# EAGLE design new_PowerBoard_V1 (EAGLE 5.11)
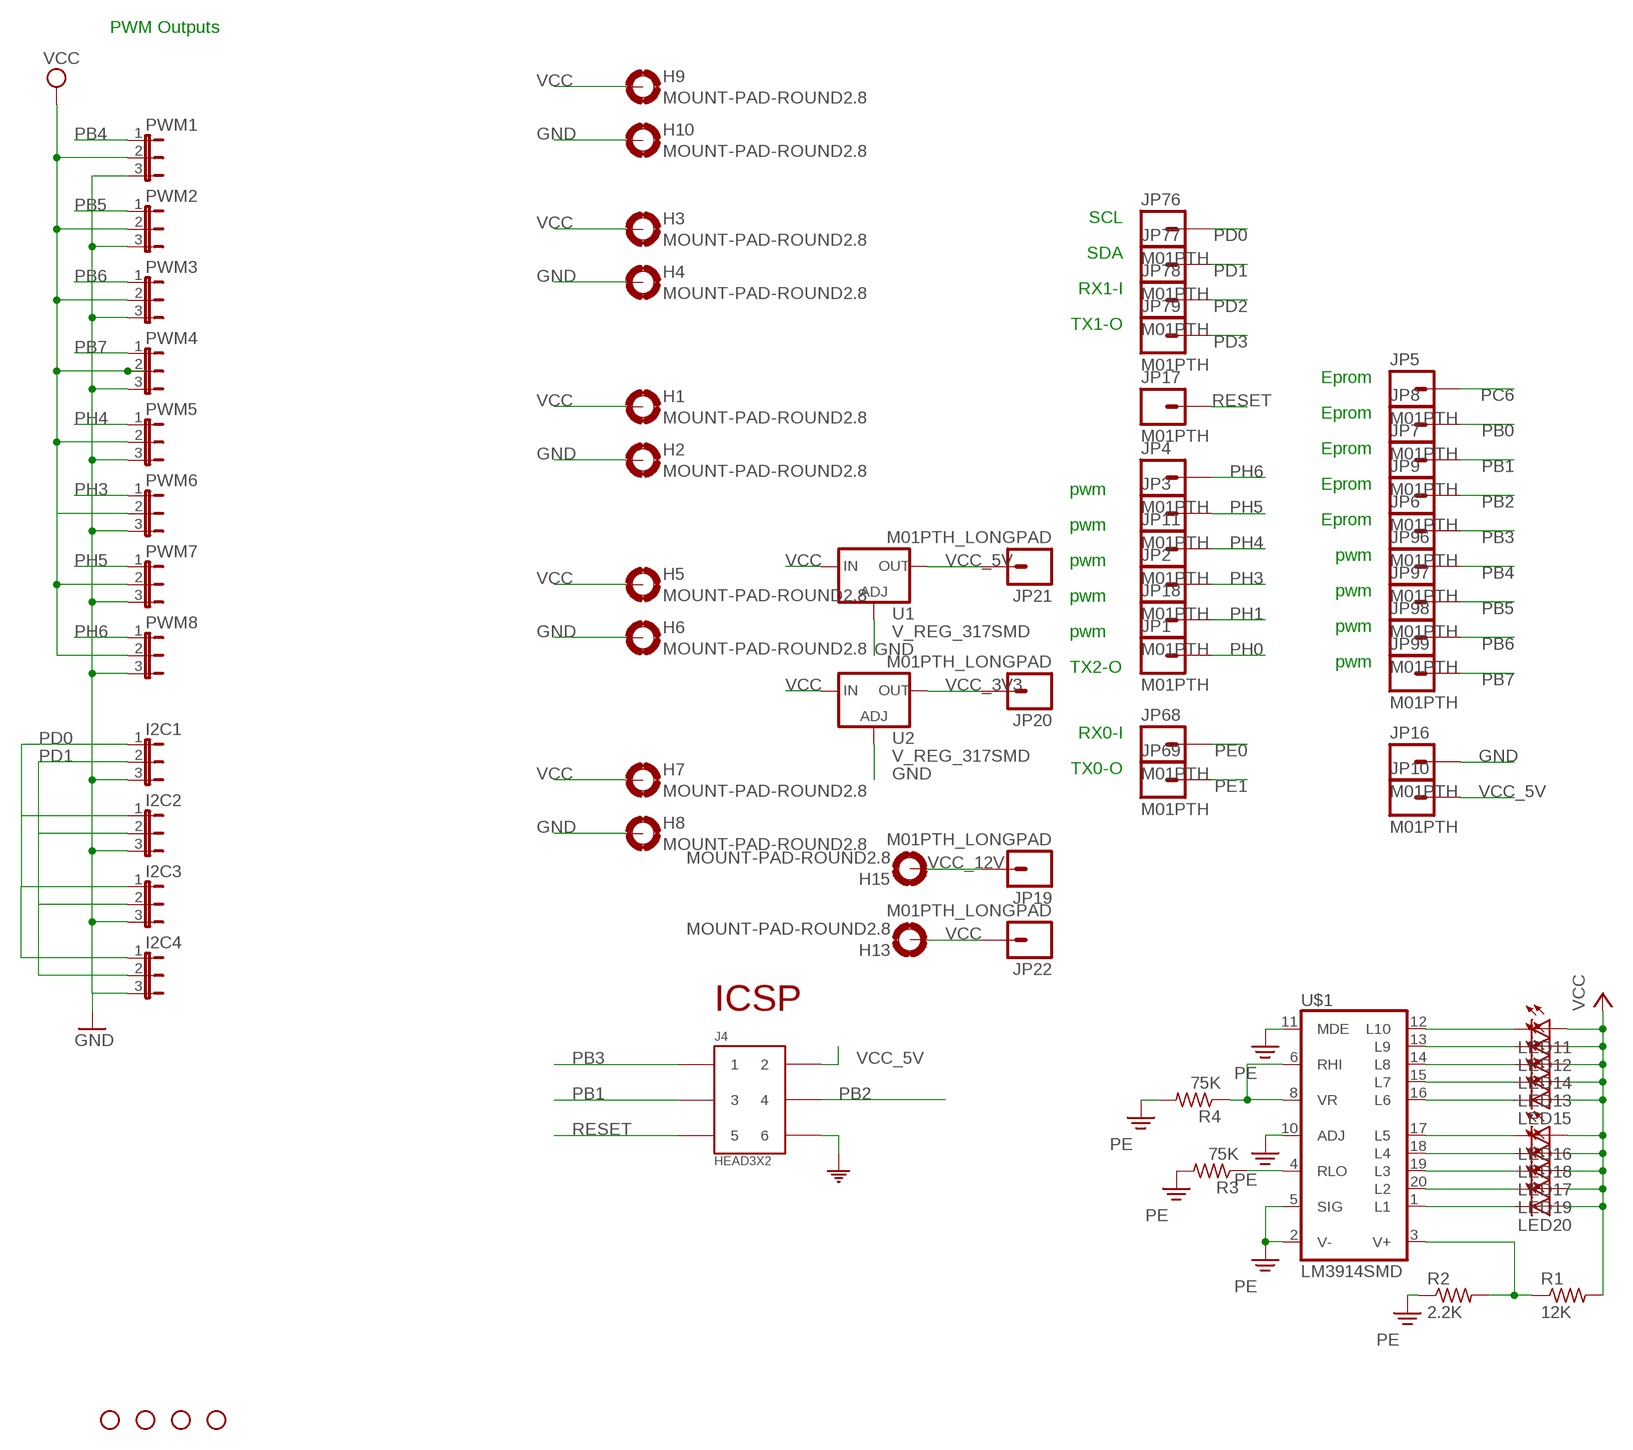
[diagram p0: schematic, sheet 1]

## Parts
H1  MOUNT-PAD-ROUND2.8  [2,8-PAD]
H2  MOUNT-PAD-ROUND2.8  [2,8-PAD]
H3  MOUNT-PAD-ROUND2.8  [2,8-PAD]
H4  MOUNT-PAD-ROUND2.8  [2,8-PAD]
H5  MOUNT-PAD-ROUND2.8  [2,8-PAD]
H6  MOUNT-PAD-ROUND2.8  [2,8-PAD]
H7  MOUNT-PAD-ROUND2.8  [2,8-PAD]
H8  MOUNT-PAD-ROUND2.8  [2,8-PAD]
H9  MOUNT-PAD-ROUND2.8  [2,8-PAD]
H10  MOUNT-PAD-ROUND2.8  [2,8-PAD]
H13  MOUNT-PAD-ROUND2.8  [2,8-PAD]
H15  MOUNT-PAD-ROUND2.8  [2,8-PAD]
I2C1  JP2E  [JP2]
I2C2  JP2E  [JP2]
I2C3  JP2E  [JP2]
I2C4  JP2E  [JP2]
J4  HEAD3X2  [HEAD3X2]
JP1  M01PTH  [1X01]
JP2  M01PTH  [1X01]
JP3  M01PTH  [1X01]
JP4  M01PTH  [1X01]
JP5  M01PTH  [1X01]
JP6  M01PTH  [1X01]
JP7  M01PTH  [1X01]
JP8  M01PTH  [1X01]
JP9  M01PTH  [1X01]
JP10  M01PTH  [1X01]
JP11  M01PTH  [1X01]
JP12  STAND-OFF  [STAND-OFF]
JP13  STAND-OFF  [STAND-OFF]
JP14  STAND-OFF  [STAND-OFF]
JP15  STAND-OFF  [STAND-OFF]
JP16  M01PTH  [1X01]
JP17  M01PTH  [1X01]
JP18  M01PTH  [1X01]
JP19  M01PTH_LONGPAD  [1X01_LONGPAD]
JP20  M01PTH_LONGPAD  [1X01_LONGPAD]
JP21  M01PTH_LONGPAD  [1X01_LONGPAD]
JP22  M01PTH_LONGPAD  [1X01_LONGPAD]
JP68  M01PTH  [1X01]
JP69  M01PTH  [1X01]
JP76  M01PTH  [1X01]
JP77  M01PTH  [1X01]
JP78  M01PTH  [1X01]
JP79  M01PTH  [1X01]
JP96  M01PTH  [1X01]
JP97  M01PTH  [1X01]
JP98  M01PTH  [1X01]
JP99  M01PTH  [1X01]
LED11  LEDCHIP-LED0603  [CHIP-LED0603]
LED12  LEDCHIP-LED0603  [CHIP-LED0603]
LED13  LEDCHIP-LED0603  [CHIP-LED0603]
LED14  LEDCHIP-LED0603  [CHIP-LED0603]
LED15  LEDCHIP-LED0603  [CHIP-LED0603]
LED16  LEDCHIP-LED0603  [CHIP-LED0603]
LED17  LEDCHIP-LED0603  [CHIP-LED0603]
LED18  LEDCHIP-LED0603  [CHIP-LED0603]
LED19  LEDCHIP-LED0603  [CHIP-LED0603]
LED20  LEDCHIP-LED0603  [CHIP-LED0603]
PWM1  JP2E  [JP2]
PWM2  JP2E  [JP2]
PWM3  JP2E  [JP2]
PWM4  JP2E  [JP2]
PWM5  JP2E  [JP2]
PWM6  JP2E  [JP2]
PWM7  JP2E  [JP2]
PWM8  JP2E  [JP2]
R1  12K  R-US_R0805  [R0805]
R2  2.2K  R-US_R0805  [R0805]
R3  75K  R-US_R0805  [R0805]
R4  75K  R-US_R0805  [R0805]
U1  V_REG_317SMD  [SOT223]
U2  V_REG_317SMD  [SOT223]
U$1  LM3914SMD  [PLCC20S]

## Nets
GND: H2.B2,8(MOUNT) H4.B2,8(MOUNT) H6.B2,8(MOUNT) H8.B2,8(MOUNT) H10.B2,8(MOUNT) I2C1.3 I2C2.3 I2C3.3 I2C4.3 J4.6 JP16.1 PWM1.3 PWM2.3 PWM3.3 PWM4.3 PWM5.3 PWM6.3 PWM7.3 PWM8.3 U1.1(ADJ) U2.1(ADJ) ; supply symbol labelled COM
N$1: R1.1 R2.2 U$1.3(V+)
N$2: LED11.C U$1.12(L10)
N$3: LED12.C U$1.13(L9)
N$4: LED14.C U$1.14(L8)
N$5: LED13.C U$1.15(L7)
N$7: LED15.C U$1.16(L6)
N$8: LED16.C U$1.17(L5)
N$9: LED18.C U$1.18(L4)
N$10: LED17.C U$1.19(L3)
N$11: LED19.C U$1.20(L2)
N$12: LED20.C U$1.1(L1)
N$14: R3.1 U$1.4(RLO)
N$15: R4.1 U$1.6(RHI) U$1.8(VR)
PB0: JP8.1
PB1: J4.3 JP7.1
PB2: J4.4 JP9.1
PB3: J4.1 JP6.1
PB4: JP96.1 PWM1.1
PB5: JP97.1 PWM2.1
PB6: JP98.1 PWM3.1
PB7: JP99.1 PWM4.1
PC6: JP5.1
PD0: I2C1.1 I2C2.1 I2C3.1 I2C4.1 JP76.1
PD1: I2C1.2 I2C2.2 I2C3.2 I2C4.2 JP77.1
PD2: JP78.1
PD3: JP79.1
PE: R2.1 R3.2 R4.2 U$1.2(V-) U$1.5(SIG) U$1.10(ADJ) U$1.11(MDE)
PE0: JP68.1
PE1: JP69.1
PH0: JP1.1
PH1: JP18.1
PH3: JP2.1 PWM6.1
PH4: JP11.1 PWM5.1
PH5: JP3.1 PWM7.1
PH6: JP4.1 PWM8.1
RESET: J4.5 JP17.1
VCC: H1.B2,8(MOUNT) H3.B2,8(MOUNT) H5.B2,8(MOUNT) H7.B2,8(MOUNT) H9.B2,8(MOUNT) H13.B2,8(MOUNT) JP22.1 LED11.A LED12.A LED13.A LED14.A LED15.A LED16.A LED17.A LED18.A LED19.A LED20.A PWM7.2 PWM8.2 R1.2 U1.3(IN) U2.3(IN)
VCC_3V3: JP20.1 U2.2(OUT)
VCC_5V: J4.2 JP10.1 JP21.1 PWM1.2 PWM2.2 PWM3.2 PWM4.2 PWM5.2 PWM6.2 U1.2(OUT) ; supply symbol labelled VCC
VCC_12V: H15.B2,8(MOUNT) JP19.1

## Notes on the sheet
- PWM Outputs
- SCL
- SDA
- RX1-I
- TX1-O
- Eprom
- Eprom
- Eprom
- Eprom
- pwm
- Eprom
- pwm
- pwm
- pwm
- pwm
- pwm
- pwm
- pwm
- pwm
- TX2-O
- RX0-I
- TX0-O
- ICSP

## Library data of the parts
H1-H10 H13 H15 = holes:MOUNT-PAD-ROUND: MOUNTING PAD, round
I2C1-I2C4 PWM1-PWM8 = jumper:JP2E: JUMPER
J4 = MyCON2:HEAD3X2
JP1-JP11 JP16-JP18 JP68 JP69 JP76-JP79 JP96-JP99 = DIYdrones3:M01: Header 1 Standard 1-pin 0.1" header. Use with straight break away headers (SKU : PRT-00116), right angle break away headers (PRT-00553), swiss pins (PRT-00743), machine pins (PRT-00117), and female headers (PRT-00115).
JP12-JP15 = SparkFun:STAND-OFF: Stand Off This is the mechanical footprint for a #4 phillips button head screw. Use the keepout ring to avoid running the screw head into surrounding components. SKU : PRT-00447
JP19-JP22 = SparkFun:M01: Header 1 Standard 1-pin 0.1" header. Use with straight break away headers (SKU : PRT-00116), right angle break away headers (PRT-00553), swiss pins (PRT-00743), machine pins (PRT-00117), and female headers (PRT-00115).
LED11-LED20 = led:LED: LED OSRAM: - CHIPLED LG R971, LG N971, LY N971, LG Q971, LY Q971, LO R971, LY R971 LH N974, LH R974 LS Q976, LO Q976, LY Q976 LO Q996 - Hyper CHIPLED LW Q18S LB Q993, LB Q99A, LB R99A - SideLED LS A670, LO A670, LY A670, LG A670, LP A670 LB A673, LV A673, LT A673, LW A673 LH A674 LY A675 LS A676, LA A676, LO A676, LY A676, LW A676 LS A679, LY A679, LG A679 - Hyper Micro SIDELED® LS Y876, LA Y876, LO Y876, LY Y876 LT Y87S - SmartLED LW L88C, LW L88S LB L89C, LB L89S, LG L890 LS L89K, LO L89K, LY L89K LS L896, LA L896, LO L896, LY L896 - TOPLED LS T670, LO T670, LY T670, LG T670, LP T670 LSG T670, LSP T670, LSY T670, LOP T670, LYG T670 LG T671, LOG T671, LSG T671 LB T673, LV T673, LT T673, LW T673 LH T674 LS T676, LA T676, LO T676, LY T676, LB T676, LH T676, LSB T676, LW T676 LB T67C, LV T67C, LT T67C, LS T67K, LO T67K, LY T67K, LW E67C LS E67B, LA E67B, LO E67B, LY E67B, LB E67C, LV E67C, LT E67C LW T67C LS T679, LY T679, LG T679 LS T770, LO T770, LY T770, LG T770, LP T770 LB T773, LV T773, LT T773, LW T773 LH T774 LS E675, LA E675, LY E675, LS T675 LS T776, LA T776, LO T776, LY T776, LB T776 LHGB T686 LT T68C, LB T68C - Hyper Mini TOPLED® LB M676 - Mini TOPLED Santana® LG M470 LS M47K, LO M47K, LY M47K Source: http://www.osram.convergy.de LUXEON: - LUMILED® LXK2-PW12-R00, LXK2-PW12-S00, LXK2-PW14-U00, LXK2-PW14-V00 LXK2-PM12-R00, LXK2-PM12-S00, LXK2-PM14-U00 LXK2-PE12-Q00, LXK2-PE12-R00, LXK2-PE12-S00, LXK2-PE14-T00, LXK2-PE14-U00 LXK2-PB12-K00, LXK2-PB12-L00, LXK2-PB12-M00, LXK2-PB14-N00, LXK2-PB14-P00, LXK2-PB14-Q00 LXK2-PR12-L00, LXK2-PR12-M00, LXK2-PR14-Q00, LXK2-PR14-R00 LXK2-PD12-Q00, LXK2-PD12-R00, LXK2-PD12-S00 LXK2-PH12-R00, LXK2-PH12-S00 LXK2-PL12-P00, LXK2-PL12-Q00, LXK2-PL12-R00 Source: www.luxeon.com KINGBRIGHT: KA-3528ASYC Source: www.kingbright.com
R1-R4 = resistor:R-US_: RESISTOR, American symbol
U1 U2 = SparkFun:V_REG_317: Voltage Regulator Standard LM317 adjustable voltage regulator. AOI (Adjust Output Input). Google 'LM317 Calculator' for easy to use app to get the two resistor values needed. 240/720 for 5V output. 240/390 for 3.3V output. Spark Fun Electronics SKU : COM-00527
U$1 = linear:LM3914SMD

## Board
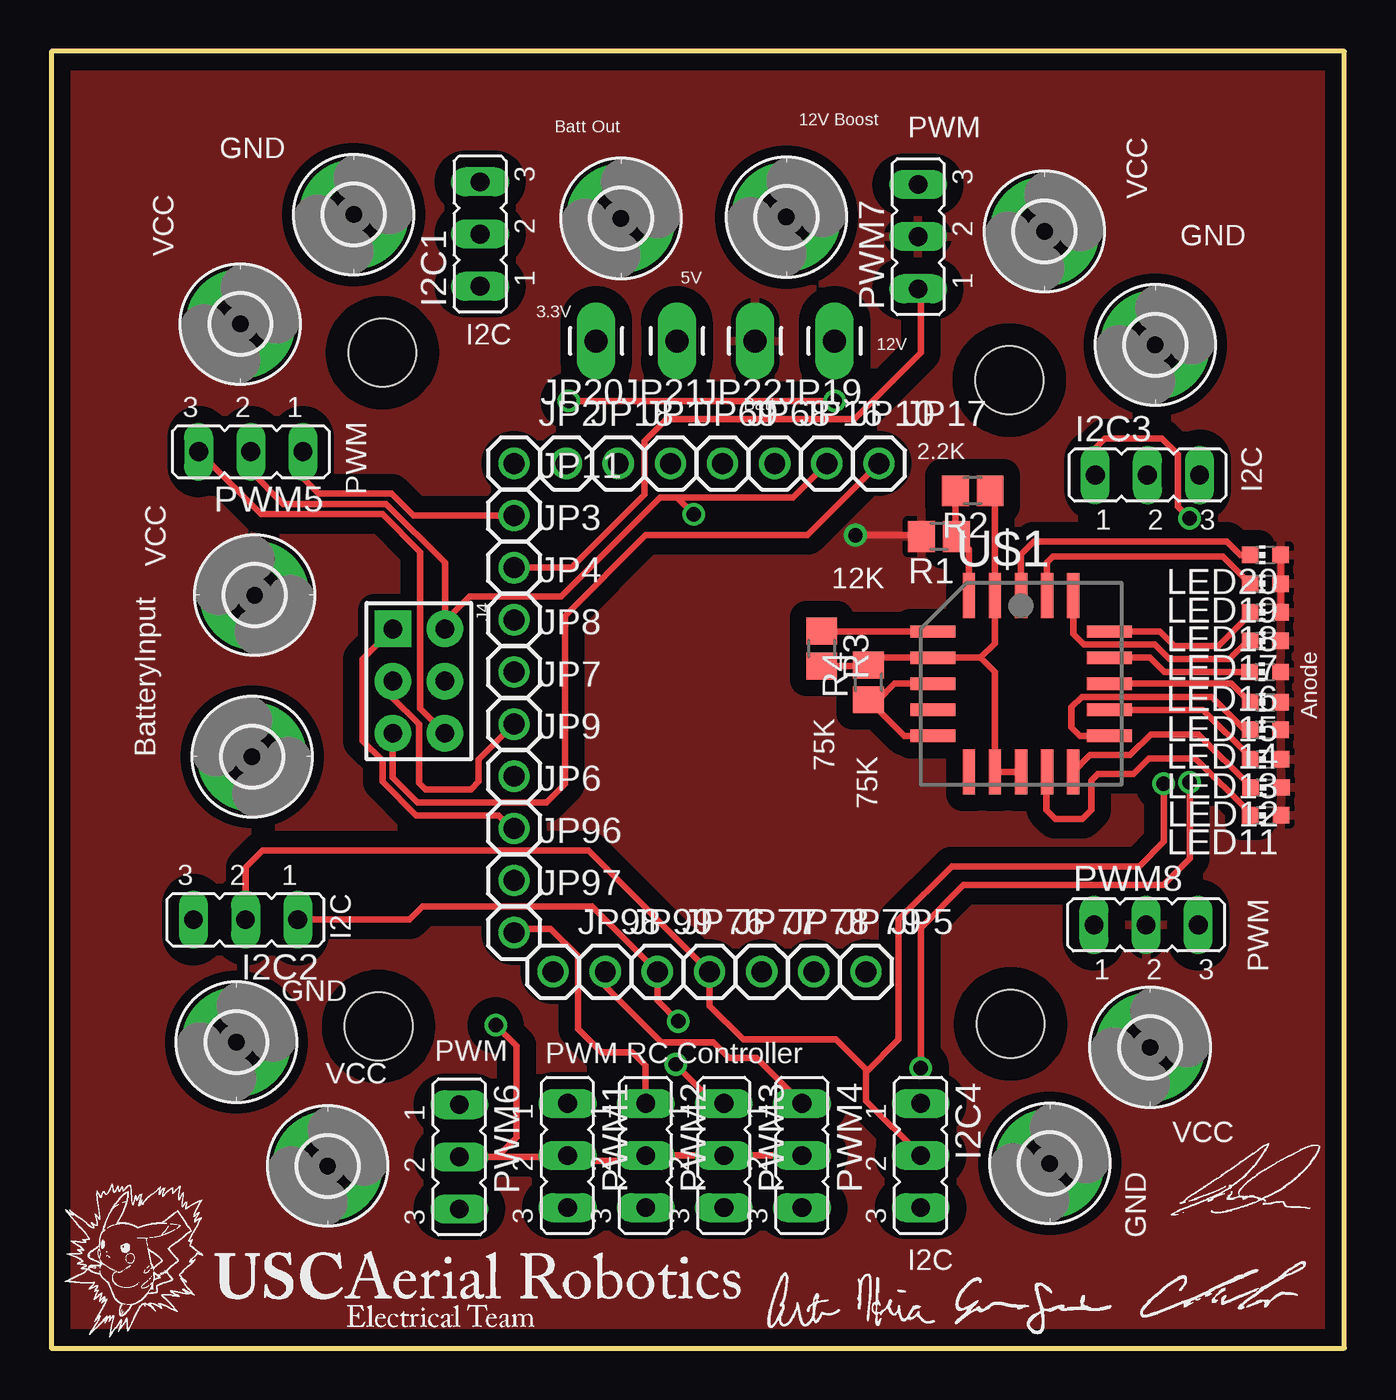
[diagram p1: board, top side]
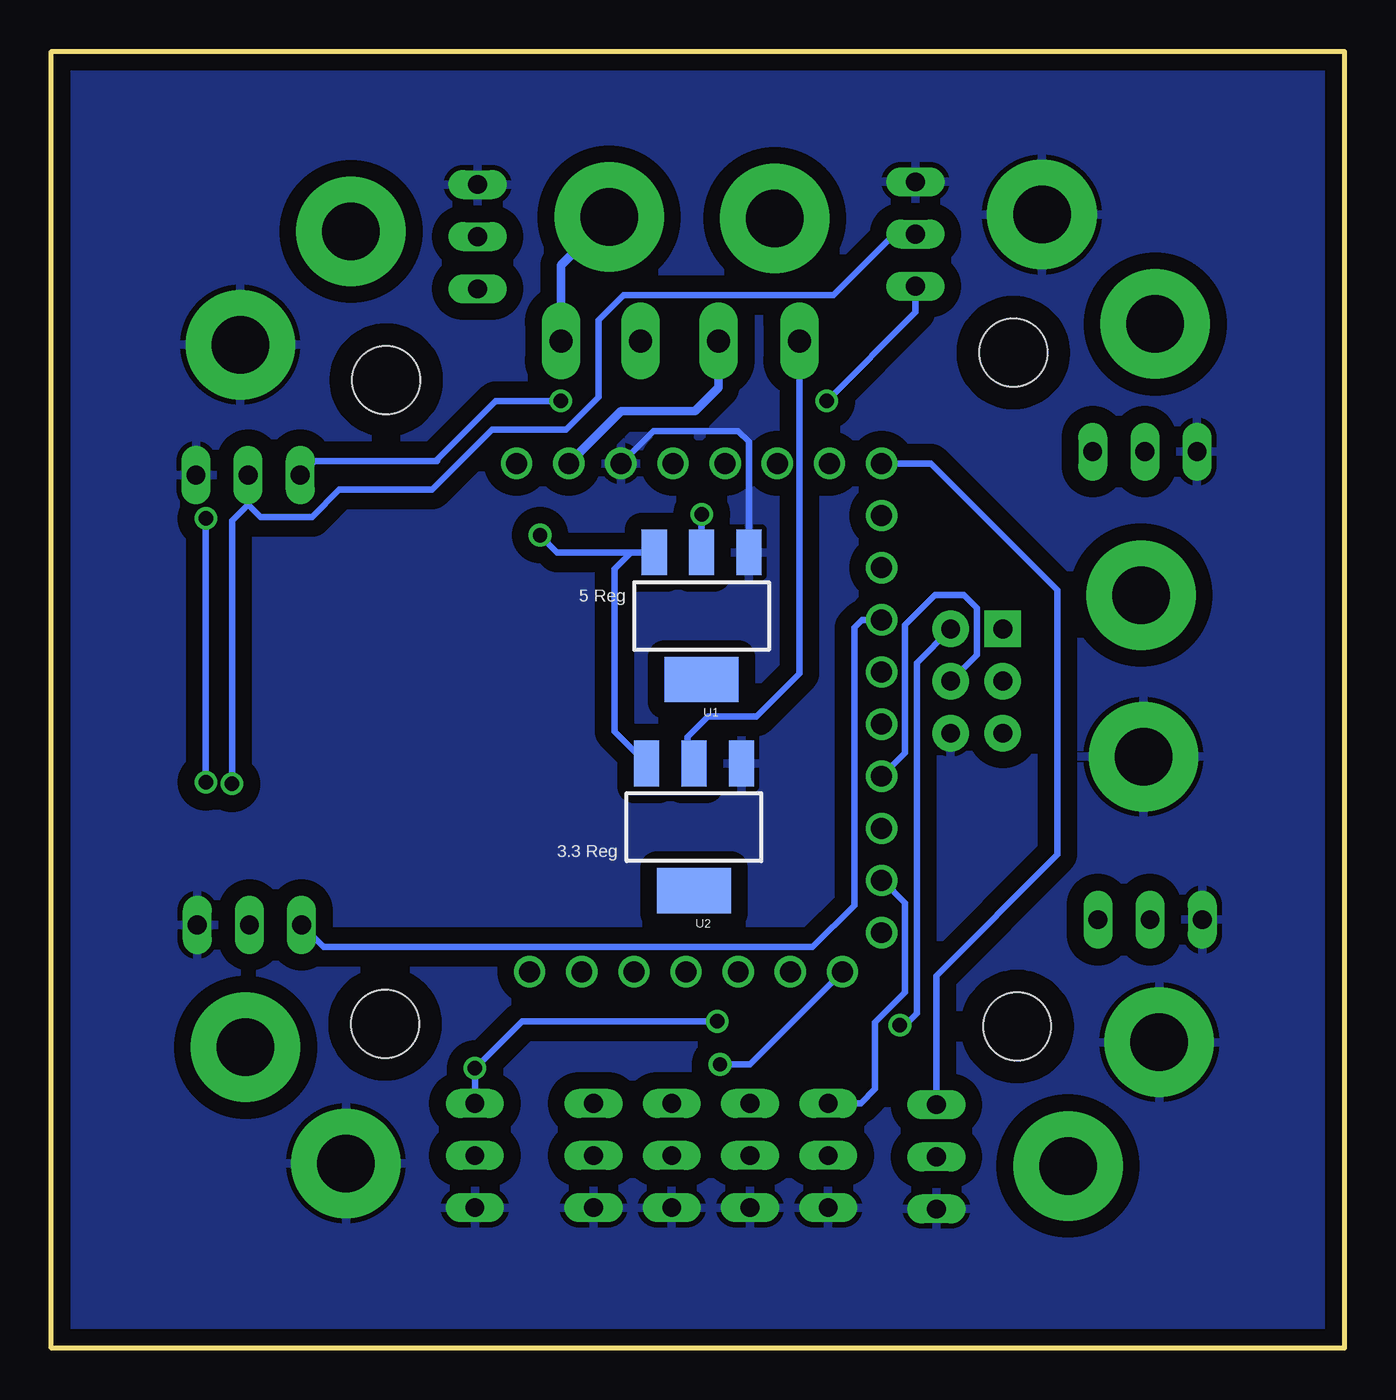
[diagram p2: board, bottom side, seen from below]

Size 62.99 x 63.18 mm. Coordinates in mm from the lower left corner, seen from the top.
Outline: 0,0 62.99,0 62.99,63.18 0,63.18 0,0
Copper layers (1*16): Top 0.0356mm / dielectric 1.5011mm / Bottom 0.0356mm
Design rules "Aerial-2Layer *": minimum track width 10mil, minimum drill 15mil, track to track 6mil, track to pad 6mil, pad to pad 6mil, via to via 6mil, smd to smd 6mil, copper to edge 15mil, drill to drill 8mil, minimum pad ring 10mil, minimum via ring 8mil, stop-mask expansion 4mil, vias tented up to drill 0mil, thermal gap 10mil

### Footprints (pad centres in the part's own frame; a part is rotated, then mirrored left to right if it is on the bottom)
2,8-PAD = drill 2.8 pad 5.334 round: B2,8 0,0
JP2 = drill 0.914 long: 1 -2.54,0; 2 0,0; 3 2.54,0
HEAD3X2 = drill 0.914 pad 1.778 square: 1 0,0 | drill 0.914 pad 1.778 round: 2 0,2.54; 3 2.54,0; 4 2.54,2.54; 5 5.08,0; 6 5.08,2.54
1X01 = drill 1.016 round: 1 0,0
STAND-OFF = hole 3.302: 0,0
1X01_LONGPAD = drill 1.118 pad 1.88 long: 1 0,0
CHIP-LED0603 = smd 0.8 x 0.8: A 0,-0.75; C 0,0.75
R0805 = smd 1.3 x 1.5: 1 -0.85,0; 2 0.85,0
SOT223 = smd 1.219 x 2.235: 1 -2.311,-3.099; 2 0,-3.099; 3 2.311,-3.099 | smd 3.6 x 2.2: 4 0,3.099
PLCC20S = smd 0.6 x 2.2: 1 0,4.3; 2 -1.27,4.3; 3 -2.54,4.3; 9 -2.54,-4.3; 10 -1.27,-4.3; 11 0,-4.3; 12 1.27,-4.3; 13 2.54,-4.3; 19 2.54,4.3; 20 1.27,4.3 | smd 2.2 x 0.6: 4 -4.3,2.54; 5 -4.3,1.27; 6 -4.3,0; 7 -4.3,-1.27; 8 -4.3,-2.54; 14 4.3,-2.54; 15 4.3,-1.27; 16 4.3,0; 17 4.3,1.27; 18 4.3,2.54

### Placement (x,y rotation side)
H1  9.91,36.69 270 top
H2  9.78,28.82 270 top
H3  53.53,14.66 0 top
H4  48.64,9 0 top
H5  48.39,54.41 0 top
H6  53.78,48.88 0 top
H7  9.21,49.9 0 top
H8  14.73,55.23 0 top
H9  13.46,8.88 0 top
H10  9.02,14.91 0 top
H13  27.75,55.04 0 top
H15  35.81,55.11 0 top
I2C1  20.89,54.28 90 top
I2C2  9.46,20.88 180 top
I2C3  53.4,42.53 0 top
I2C4  42.35,9.39 270 top
J4  16.64,35.04 270 top
JP1  27.62,43.1 0 top
JP2  22.54,43.1 0 top
JP3  22.54,38.02 0 top
JP4  22.54,35.48 0 top
JP5  39.69,18.34 0 top
JP6  22.54,25.32 0 top
JP7  22.54,30.4 0 top
JP8  22.54,32.94 0 top
JP9  22.54,27.86 0 top
JP10  37.78,43.1 0 top
JP11  22.54,40.56 0 top
JP12  46.74,15.8 0 top
JP13  15.94,15.67 0 top
JP14  46.67,47.17 0 top
JP15  16.13,48.5 0 top
JP16  35.24,43.1 0 top
JP17  40.32,43.1 0 top
JP18  25.08,43.1 0 top
JP19  38.16,49.07 180 top
JP20  26.54,49.07 180 top
JP21  30.48,49.07 180 top
JP22  34.29,49.07 180 top
JP68  32.7,43.1 0 top
JP69  30.16,43.1 0 top
JP76  29.53,18.34 0 top
JP77  32.07,18.34 0 top
JP78  34.61,18.34 0 top
JP79  37.15,18.34 0 top
JP96  22.54,22.78 0 top
JP97  22.54,20.24 0 top
JP98  24.45,18.34 0 top
JP99  26.99,18.34 0 top
LED11  59.16,25.96 90 top
LED12  59.18,27.32 90 top
LED13  59.16,28.69 90 top
LED14  59.14,30.14 90 top
LED15  59.14,31.47 90 top
LED16  59.13,32.94 90 top
LED17  59.14,34.46 90 top
LED18  59.14,35.85 90 top
LED19  59.14,37.25 90 top
LED20  59.14,38.65 90 top
PWM1  25.15,9.39 270 top
PWM2  28.96,9.39 270 top
PWM3  32.77,9.39 270 top
PWM4  36.58,9.39 270 top
PWM5  9.72,43.68 180 top
PWM6  19.88,9.32 270 top
PWM7  42.23,54.15 90 top
PWM8  53.34,20.62 0 top
R1  43.24,39.55 180 top
R2  44.89,41.77 180 top
R3  37.53,34.09 270 top
R4  39.81,32.44 90 top
U1  31.31,35.67 180 bottom
U2  31.69,25.39 180 bottom
U$1  47.24,32.37 0 top

### Tracks (layer width: path | path; a pad name or v marks a point on that pad's centre or on a via)
GND
  Top 0.305: J4.6 17.97,31.17 17.97,38.79 16.13,40.63 10.22,40.63 PWM5.3
  Bottom 0.305: U1.1 28.99,44.16 29.53,44.69 33.65,44.69 JP16.1
  pour Bottom (isolate 0.813): -0.76,64.01 63.56,63.88 63.69,-0.7 -0.76,-0.83
N$1
  Top 0.305: U$1.3 44.7,38.94 R1.1 44.04,39.6 R2.2
N$2
  Top 0.305: LED11.C 58.41,26.07 55.74,28.74 53.48,28.74 52.72,27.98 50.99,27.98 50.66,27.65 50.66,26.23 50.23,25.79 48.91,25.79 48.48,26.23 48.48,28.03 U$1.12
N$3
  Top 0.305: LED12.C 58.43,27.37 55.89,29.91 53.56,29.91 52.54,28.89 50.6,28.89 U$1.13
N$4
  Top 0.305: LED14.C 58.13,30.14 56.53,31.74 50.2,31.74 49.7,31.23 49.7,30.24 50.1,29.83 U$1.14
N$5
  Top 0.305: LED13.C 58.41,28.79 56.1,31.1 U$1.15
N$7
  Top 0.305: U$1.16 57.49,32.37 LED15.C
N$8
  Top 0.305: LED16.C 54.23,32.94 53.53,33.64 U$1.17
N$9
  Top 0.305: LED18.C 58.39,35.74 56.86,34.2 54.72,34.2 54.01,34.91 U$1.18
N$10
  Top 0.305: LED17.C 58.28,34.46 57.39,33.57 54.47,33.57 53.76,34.28 50.3,34.28 49.8,34.79 49.8,36.66 U$1.19
N$11
  Top 0.305: U$1.20 48.51,38.28 48.81,38.57 57.07,38.57 LED19.C
N$12
  Top 0.305: LED20.C 57.92,38.65 57.26,39.31 47.87,39.31 47.23,38.67 47.23,36.69 U$1.1
N$14
  Top 0.305: U$1.4 37.55,34.91 R3.1
N$15
  Top 0.305: U$1.8 41.57,29.83 R4.1 40.3,31.59 41.08,32.37 U$1.6
PB1
  Top 0.305: JP7.1 22.54,30.34 22.48,30.34 20.83,28.69 20.83,27.61 20.45,27.23 18.22,27.23 17.91,27.55 17.91,30.4 16.64,31.67 J4.3
PB2
  Bottom 0.305: J4.4 17.91,33.77 17.91,36.06 18.54,36.69 19.94,36.69 21.4,35.23 21.4,29.01 JP9.1
PB3
  Top 0.305: JP6.1 22.42,25.32 21.78,25.96 17.78,25.96 16.13,27.61 16.13,28.63 15.18,29.58 15.18,33.58 J4.1
PB4
  Bottom 0.305: JP96.1 22.48,22.78 21.4,21.7 21.4,17.32 22.86,15.86 22.86,12.62 23.56,11.93 PWM1.1
PB5
  Top 0.305: PWM2.1 28.96,13.77 28.32,14.4 26.8,14.4 25.65,15.54 25.65,19.1 24.32,20.43 22.73,20.43 JP97.1
PB6  (via drill 0.7)
  Top 0.305: PWM3.1 32.32,11.93 v30.42,13.83
  Bottom 0.305: v30.42,13.83 28.96,13.83 JP98.1
PB7
  Top 0.305: JP99.1 26.99,17.64 29.72,14.91 32.26,14.91 33.02,14.15 34.35,14.15 PWM4.1
PD0  (via drill 0.7)
  Top 0.305: v30.54,15.93 29.53,16.94 JP76.1 26.35,21.51 18.1,21.51 17.46,20.88 I2C2.1 | v38.16,46.15 v25.21,46.15 | I2C3.1 50.84,42.56 50.84,43.83 51.32,44.31 54.11,44.31 54.88,43.55 54.88,41.01 v55.46,40.42 | v42.35,13.64 42.35,20.49 44.44,22.57 54.17,22.57 55.46,23.86 v55.46,27.57
  Bottom 0.305: v30.54,15.93 40.07,15.93 v42.35,13.64 I2C4.1 | I2C3.1 50.17,43.23 44.2,43.23 44.2,43.29 41.34,46.15 v38.16,46.15 | I2C1.1 20.89,50.47 v25.21,46.15 | v55.46,27.57 v55.46,40.42
PD1  (via drill 0.7)
  Top 0.305: 39.69,13.45 39.69,13.58 38.23,15.04 33.72,15.04 32.07,16.69 JP77.1 26.16,24.24 10.29,24.24 9.46,23.42 I2C2.2 | 39.69,13.45 39.69,12.05 I2C4.2 | 39.69,13.45 41.28,15.04 41.28,20.88 43.88,23.48 53,23.48 54.19,24.68 v54.19,27.5
  Bottom 0.305: I2C1.2 21.91,54.28 24.89,51.3 35.12,51.3 36.32,50.09 36.32,46.34 37.91,44.75 41.53,44.75 44.45,41.83 48.96,41.83 50.29,40.5 52.79,40.5 53.4,41.11 | 53.4,41.11 I2C3.2 | v54.19,27.5 54.19,40.32 53.4,41.11
PE
  Top 0.305: R3.2 39.77,33.24 R4.2 40.17,33.64 U$1.5 45.28,33.64 | U$1.11 U$1.10 45.97,32.94 45.28,33.64 | 45.28,33.64 45.97,34.34 U$1.2 45.97,41.54 R2.1
PH3
  Bottom 0.305: PWM6.1 19.88,18.15 13.97,24.05 13.97,36.94 20.13,43.1 JP2.1
PH4
  Top 0.305: JP11.1 17.65,40.56 16.57,41.64 13.02,41.64 12.26,42.41 PWM5.1
PH5
  Top 0.305: PWM7.1 42.35,51.49 42.35,48.5 39.12,45.26 29.97,45.26 28.89,44.18 28.89,41.58 25.34,38.02 JP3.1
PH6
  Bottom 0.305: JP4.1 23.49,35.48 23.88,35.1 23.88,21.58 25.91,19.55 49.72,19.55 PWM8.1
RESET
  Top 0.305: J4.5 16.64,27.8 17.84,26.59 24.13,26.59 25.02,27.48 25.02,35.67 28.96,39.61 36.83,39.61 JP17.1
VCC  (via drill 0.7)
  Top 0.305: v39.18,39.61 42.33,39.61 R1.2 | LED16.A | LED18.A LED19.A LED20.A
  Bottom 0.305: 34.75,38.77 38.34,38.77 v39.18,39.61 | 34.75,38.77 U1.3 | 34.75,38.77 35.56,37.96 35.56,30.05 U2.3
  pour Top (isolate 0.813): -0.7,63.94 63.18,63.82 63.63,-0.76 -0.57,-0.7
VCC_3V3
  Bottom 0.305: JP20.1 26.54,32.88 28.64,30.78 30.99,30.78 32,29.77 32,28.8 U2.2
VCC_5V  (via drill 0.7)
  Top 0.305: PWM4.2 PWM3.2 PWM2.2 29.15,9.39 29.21,9.32 29.08,9.32 28.89,9.13 25.4,9.13 PWM1.2 25.08,9.32 PWM6.2 21.72,9.32 22.67,10.27 22.67,14.72 v21.65,15.74 | PWM5.2 9.72,42.72 11.3,41.14 16.32,41.14 19.18,38.28 J4.2 19.18,35.42 20.38,36.63 24.83,36.63 29.65,41.45 30.48,41.45 | JP10.1 36.13,41.45 30.48,41.45 | 30.48,41.45 v31.31,40.63
  Bottom 0.305: v21.65,15.74 21.4,15.74 20.83,16.31 20.83,33.39 J4.2 | U1.2 30.92,39.15 31.31,39.54 v31.31,40.63
  Bottom 0.406: JP21.1 30.48,46.79 31.62,45.64 35.24,45.64 JP10.1
VCC_12V
  Bottom 0.406: JP19.1 38.16,52.76 H15.B2,8

### Text on the board
tPlace: 12V Boost | PWM | Batt Out | GND | VCC | GND | VCC | 5V | 3.3V | I2C | 12V | Batt | PWM | 2.2K | I2C | VCC | 12K | Anode | BatteryInput | 75K | 75K | I2C | PWM | GND | PWM | PWM RC Controller | VCC | VCC | GND | I2C
bPlace: 5 Reg | 3.3 Reg
tDocu: GND